# EAGLE design lighting_power (EAGLE 9.7.0)
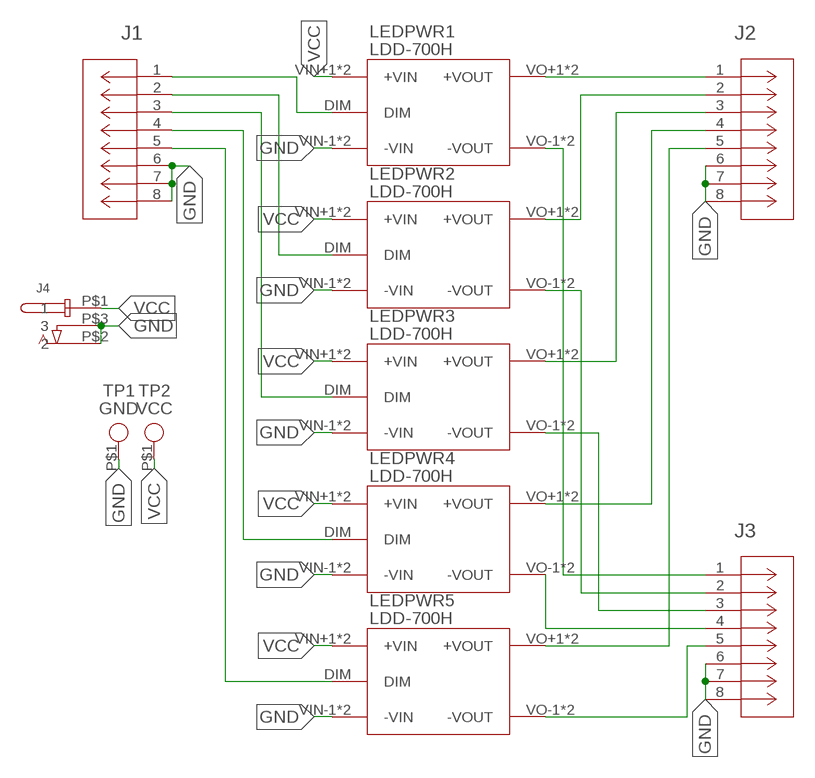
[diagram p0: schematic, sheet 1]

## Parts
J1  MOLEX-MICROLOCK-6PIN  [CON_5055670671]
J2  MOLEX-MICROLOCK-6PIN  [CON_5055670671]
J3  MOLEX-MICROLOCK-6PIN  [CON_5055670671]
J4  DCBARRELJACK  [DCBARRELJACK]
LEDPWR1  LDD-700H  NLDD-300~1000H  [NLDD-300~1000H]
LEDPWR2  LDD-700H  NLDD-300~1000H  [NLDD-300~1000H]
LEDPWR3  LDD-700H  NLDD-300~1000H  [NLDD-300~1000H]
LEDPWR4  LDD-700H  NLDD-300~1000H  [NLDD-300~1000H]
LEDPWR5  LDD-700H  NLDD-300~1000H  [NLDD-300~1000H]
TP1  GND  TP_CIRCLE_2.5MM  [TP_CIRCLE_2.5MM]
TP2  VCC  TP_CIRCLE_2.5MM  [TP_CIRCLE_2.5MM]

## Nets
GND: J1.6 J1.7 J1.8 J2.6 J2.7 J2.8 J3.6 J3.7 J3.8 J4.P$3 LEDPWR1.VIN-1(-VIN) LEDPWR1.VIN-2(-VIN) LEDPWR2.VIN-1(-VIN) LEDPWR2.VIN-2(-VIN) LEDPWR3.VIN-1(-VIN) LEDPWR3.VIN-2(-VIN) LEDPWR4.VIN-1(-VIN) LEDPWR4.VIN-2(-VIN) LEDPWR5.VIN-1(-VIN) LEDPWR5.VIN-2(-VIN) TP1.P$1
N$1: J1.1 LEDPWR1.DIM
N$2: J1.2 LEDPWR2.DIM
N$3: J1.3 LEDPWR3.DIM
N$4: J1.4 LEDPWR4.DIM
N$5: J1.5 LEDPWR5.DIM
N$6: J2.1 LEDPWR1.VO+1(+VOUT) LEDPWR1.VO+2(+VOUT)
N$7: J2.2 LEDPWR2.VO+1(+VOUT) LEDPWR2.VO+2(+VOUT)
N$8: J2.3 LEDPWR3.VO+1(+VOUT) LEDPWR3.VO+2(+VOUT)
N$9: J2.4 LEDPWR4.VO+1(+VOUT) LEDPWR4.VO+2(+VOUT)
N$10: J2.5 LEDPWR5.VO+1(+VOUT) LEDPWR5.VO+2(+VOUT)
N$11: J3.1 LEDPWR1.VO-1(-VOUT) LEDPWR1.VO-2(-VOUT)
N$12: J3.2 LEDPWR2.VO-1(-VOUT) LEDPWR2.VO-2(-VOUT)
N$13: J3.3 LEDPWR3.VO-1(-VOUT) LEDPWR3.VO-2(-VOUT)
N$14: J3.4 LEDPWR4.VO-1(-VOUT) LEDPWR4.VO-2(-VOUT)
N$15: J3.5 LEDPWR5.VO-1(-VOUT) LEDPWR5.VO-2(-VOUT)
N$16: J4.P$2
VCC: J4.P$1 LEDPWR1.VIN+1(+VIN) LEDPWR1.VIN+2(+VIN) LEDPWR2.VIN+1(+VIN) LEDPWR2.VIN+2(+VIN) LEDPWR3.VIN+1(+VIN) LEDPWR3.VIN+2(+VIN) LEDPWR4.VIN+1(+VIN) LEDPWR4.VIN+2(+VIN) LEDPWR5.VIN+1(+VIN) LEDPWR5.VIN+2(+VIN) TP2.P$1

## Library data of the parts
J1-J3 = Molex Micro-Lock PLUS 6-Pin 90deg:MOLEX-MICROLOCK-6PIN
J4 = DC Barrel Jack (Locking):DCBARRELJACK
LEDPWR1-LEDPWR5 = MeanWell NLDD-H Series:NLDD-300~1000H
TP1 TP2 = Test Point:TP_CIRCLE_2.5MM

## Net classes
0 default: width 0.254 mm, clearance 0.762 mm

## Board
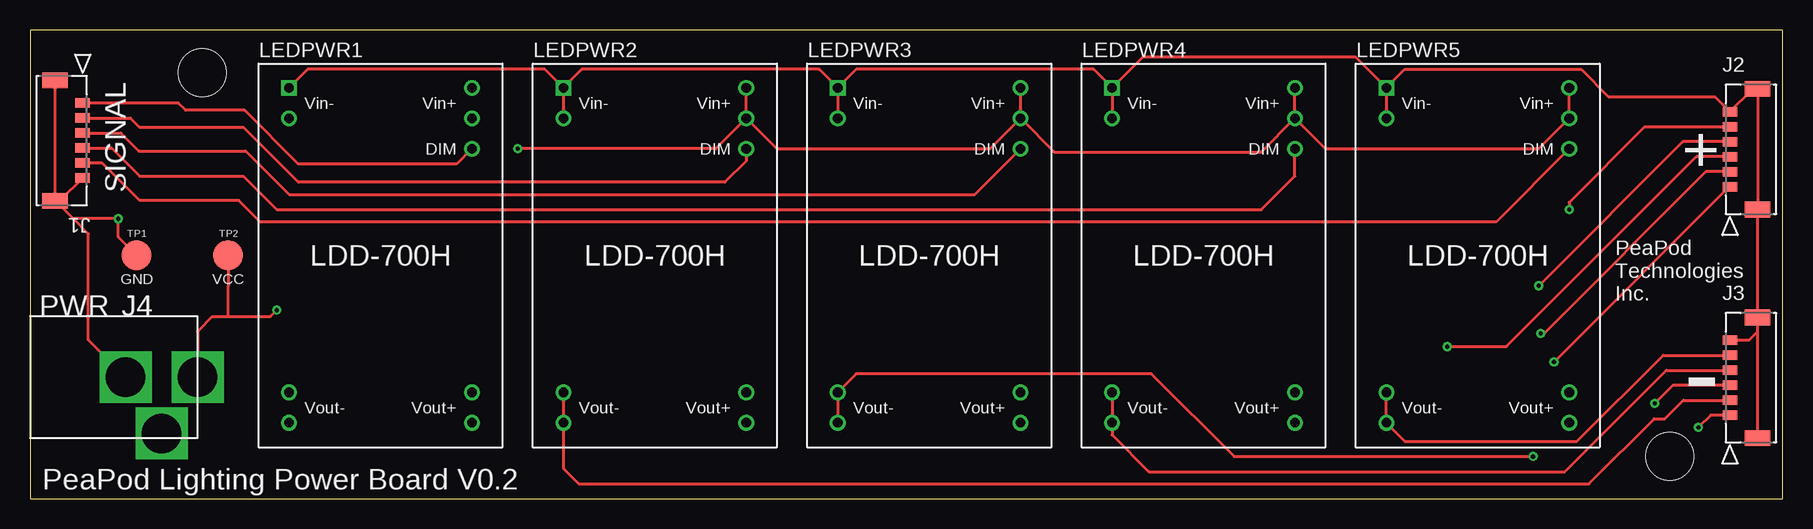
[diagram p1: board, top side]
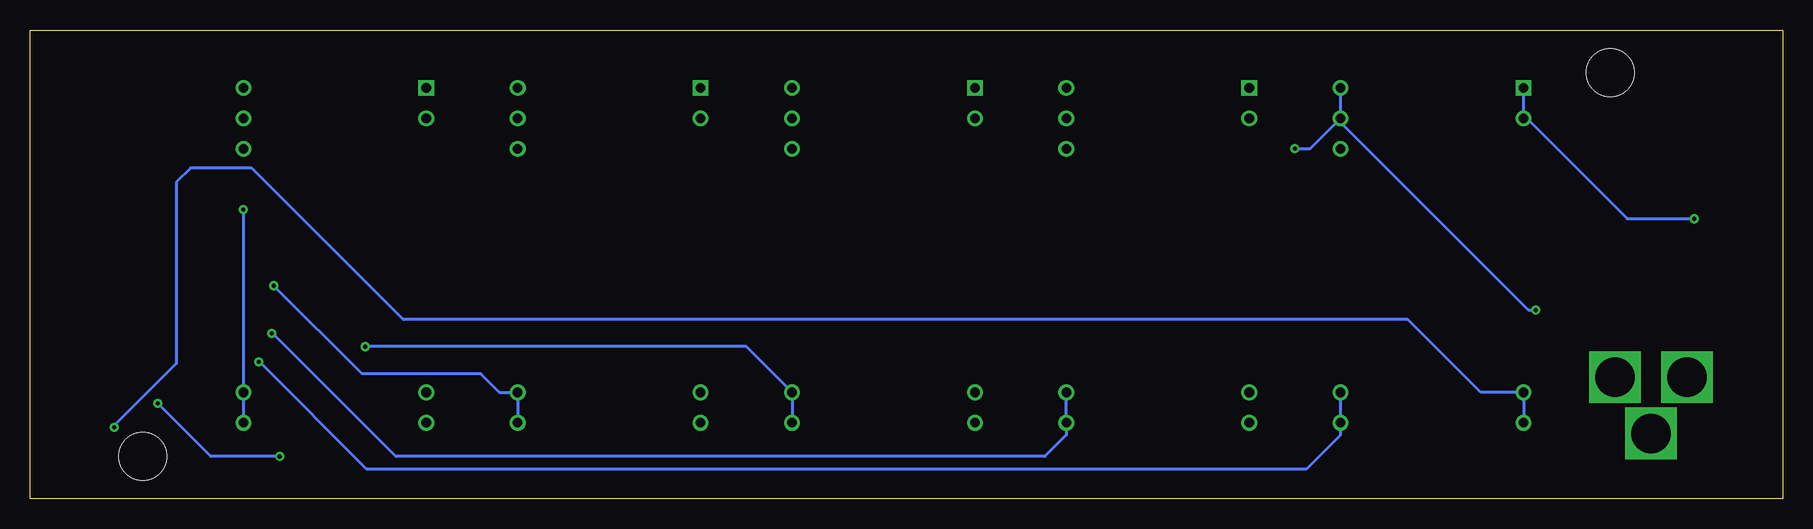
[diagram p2: board, bottom side, seen from below]

Size 146.05 x 39.12 mm. Coordinates in mm from the lower left corner, seen from the top.
Outline: 0,0 146.05,0 146.05,39.12 0,39.12 0,0
Copper layers (1*16): Top 0.035mm / dielectric 1.5mm / Bottom 0.035mm
Design rules "default": minimum track width 6mil, minimum drill 0.35mm, track to track 6mil, track to pad 6mil, pad to pad 6mil, via to via 6mil, smd to smd 6mil, copper to edge 40mil, drill to drill 6mil, minimum pad ring 10mil, minimum via ring 8mil, stop-mask expansion 4mil, vias tented up to drill 0mil, thermal gap 10mil
Holes 4 mm at 14.35,35.56 136.65,3.56

### Footprints (pad centres in the part's own frame; a part is rotated, then mirrored left to right if it is on the bottom)
CON_5055670671 = smd 0.8 x 1.2: 1 0,0; 2 -1.25,0; 3 -2.5,0; 4 -3.75,0; 5 -5,0; 6 -6.25,0 | smd 1.3 x 2.15: 7 1.9,2.295; 8 -8.15,2.295
DCBARRELJACK = drill 3.3 square: P$1 0,0; P$2 -3,-4.7; P$3 -6,0
NLDD-300~1000H = drill 0.8 pad 1.27: DIM 7.62,8.89; VIN+1 7.62,13.97; VIN+2 7.62,11.43; VIN-2 -7.62,11.43; VO+1 7.62,-11.43; VO+2 7.62,-13.97; VO-1 -7.62,-11.43; VO-2 -7.62,-13.97 | drill 0.8 pad 1.27 square: VIN-1 -7.62,13.97
TP_CIRCLE_2.5MM = smd 2.5 x 2.5: P$1 0,0

### Placement (x,y rotation side)
J1  4.39,33.02 90 top
J2  141.66,26.04 270 top
J3  141.66,6.98 270 top
J4  13.97,10.16 0 top
LEDPWR1  29.21,20.32 0 top
LEDPWR2  52.07,20.32 0 top
LEDPWR3  74.93,20.32 0 top
LEDPWR4  97.79,20.32 0 top
LEDPWR5  120.65,20.32 0 top
TP1  8.89,20.32 0 top
TP2  16.51,20.32 0 top

### Tracks (layer width: path | path; a pad name or v marks a point on that pad's centre or on a via)
GND  (via drill 0.35)
  Top 0.254: LEDPWR5.VIN-1 LEDPWR5.VIN-2 | LEDPWR5.VIN-1 110.49,36.83 92.71,36.83 LEDPWR4.VIN-1 | LEDPWR4.VIN-1 LEDPWR4.VIN-2 | LEDPWR4.VIN-1 88.63,35.83 68.85,35.83 LEDPWR3.VIN-1 | LEDPWR3.VIN-1 LEDPWR3.VIN-2 | LEDPWR3.VIN-1 65.77,35.83 45.99,35.83 LEDPWR2.VIN-1 | LEDPWR2.VIN-1 LEDPWR2.VIN-2 | LEDPWR2.VIN-1 42.91,35.83 23.13,35.83 LEDPWR1.VIN-1 | LEDPWR5.VIN-1 114.57,35.83 129.27,35.83 131.57,33.53 140.42,33.53 J2.6 143.56,34.18 J2.8 J2.7 J3.8 143.96,13.97 | J1.6 2.49,24.87 J1.8 | J1.8 J1.7 | J1.8 3.59,23.37 | 3.59,23.37 4.86,22.1 4.86,13.27 J4.P$3 | 3.59,23.37 v7.36,23.37 7.36,21.85 TP1.P$1 | J3.7 143.96,13.97 | J3.6 143.22,13.23 143.96,13.97
  Bottom 0.254: LEDPWR1.VIN-1 LEDPWR1.VIN-2 21.34,31.75 12.95,23.37 v7.36,23.37
N$1
  Top 0.254: LEDPWR1.DIM 35.56,27.94 22.35,27.94 17.88,32.42 12.97,32.42 12.37,33.02 J1.1
N$2
  Top 0.254: LEDPWR2.DIM 59.69,28.19 57.91,26.42 22.37,26.42 17.79,30.99 9.14,30.99 8.36,31.77 J1.2
N$3
  Top 0.254: LEDPWR3.DIM 78.74,25.4 21.59,25.4 17.97,29.02 9.08,29.02 7.58,30.52 J1.3
N$4
  Top 0.254: LEDPWR4.DIM 105.41,26.92 102.62,24.13 20.57,24.13 17.78,26.92 9.14,26.92 6.8,29.27 J1.4
N$5
  Top 0.254: LEDPWR5.DIM 122.17,23.11 19.18,23.11 17.4,24.89 9.14,24.89 6.02,28.02 J1.5
N$6  (via drill 0.35)
  Top 0.254: v127,11.43 141.6,26.04 J2.1
  Bottom 0.254: LEDPWR1.VO+1 LEDPWR1.VO+2 36.83,5.33 39.64,2.52 118.03,2.52 126.88,11.37 126.88,11.43 v127,11.43
N$7  (via drill 0.35)
  Top 0.254: v125.91,13.79 126.17,13.79 139.66,27.29 J2.2
  Bottom 0.254: LEDPWR2.VO+1 LEDPWR2.VO+2 59.69,5.33 61.49,3.54 115.57,3.54 125.83,13.79 v125.91,13.79
N$8  (via drill 0.35)
  Top 0.254: v118.11,12.7 123.02,12.7 138.86,28.54 J2.3
  Bottom 0.254: LEDPWR3.VO+2 LEDPWR3.VO+1 86.36,12.7 v118.11,12.7
N$9  (via drill 0.35)
  Top 0.254: v125.73,17.78 137.74,29.79 J2.4
  Bottom 0.254: LEDPWR4.VO+2 LEDPWR4.VO+1 106.93,8.89 108.48,10.43 118.38,10.43 v125.73,17.78
N$10  (via drill 0.35)
  Top 0.254: v128.27,24.13 128.27,24.73 134.58,31.04 J2.5
  Bottom 0.254: v128.27,24.13 LEDPWR5.VO+1 LEDPWR5.VO+2
N$11  (via drill 0.35)
  Top 0.254: J3.1 140.05,6.98 v139.03,5.97
  Bottom 0.254: LEDPWR1.VO-2 LEDPWR1.VO-1 25.15,8.89 31.22,14.97 114.94,14.97 127.58,27.6 132.67,27.6 133.86,26.42 133.86,11.29 139.03,6.12 v139.03,5.97
N$12
  Top 0.254: LEDPWR2.VO-1 LEDPWR2.VO-2 44.45,2.54 45.73,1.26 129.91,1.26 135.35,6.7 136.24,6.7 137.78,8.23 J3.2
N$13  (via drill 0.35)
  Top 0.254: LEDPWR3.VO-2 LEDPWR3.VO-1 68.85,10.43 93.45,10.43 100.35,3.54 v125.25,3.54 | J3.3 136.91,9.48 v135.39,7.97
  Bottom 0.254: v125.25,3.54 130.97,3.54 v135.39,7.97
N$14
  Top 0.254: LEDPWR4.VO-1 LEDPWR4.VO-2 90.17,5.33 93.23,2.27 127.91,2.27 136.37,10.73 J3.4
N$15
  Top 0.254: LEDPWR5.VO-1 LEDPWR5.VO-2 114.57,4.81 128.91,4.81 136.09,11.98 J3.5
VCC  (via drill 0.35)
  Top 0.254: LEDPWR2.VIN+2 57.15,29.21 v40.64,29.21 | LEDPWR2.VIN+2 LEDPWR2.VIN+1 | LEDPWR2.VIN+2 62.23,29.21 80.01,29.21 LEDPWR3.VIN+2 | LEDPWR3.VIN+2 LEDPWR3.VIN+1 | LEDPWR3.VIN+2 85.36,28.94 102.6,28.94 LEDPWR4.VIN+2 | LEDPWR4.VIN+2 LEDPWR4.VIN+1 | LEDPWR4.VIN+2 107.95,29.21 125.73,29.21 LEDPWR5.VIN+2 LEDPWR5.VIN+1 | TP2.P$1 16.47,15.2 | 16.47,15.2 15.2,15.2 13.97,13.97 J4.P$1 | 16.47,15.2 20.03,15.2 v20.57,15.75
  Bottom 0.254: v20.57,15.75 21.19,15.75 36.83,31.39 LEDPWR1.VIN+2 | LEDPWR1.VIN+2 LEDPWR1.VIN+1 | v40.64,29.21 39.37,29.21 LEDPWR1.VIN+2

### Text on the board
tPlace: SIGNAL | + | PWR | PeaPod / Technologies / Inc. | - | PeaPod Lighting Power Board V0.2